# Altium schematic sheet moFOC-Main.SchDoc
size A4; Organization: Altium Limited; Address1: L3, 12a Rodborough Rd; Address2: Frenchs Forest; Address3: NSW; Address4: Australia 2086
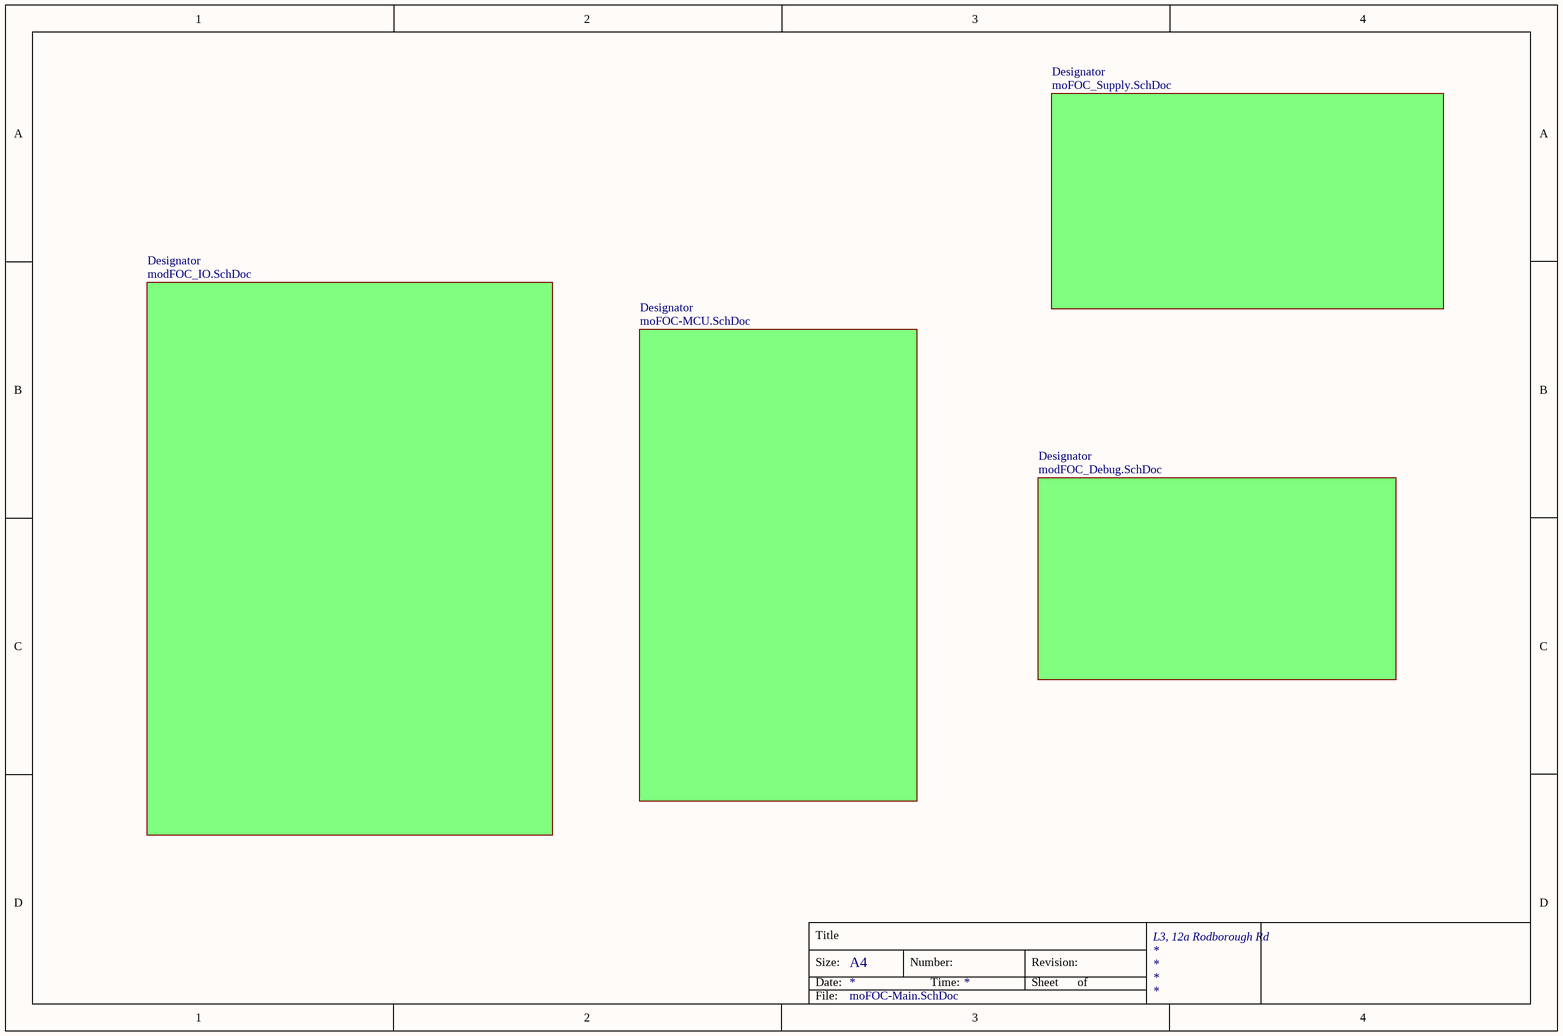
[diagram p0: moFOC-Main.SchDoc]

## Sub-sheets
Designator = moFOC-MCU.SchDoc: no entries
Designator = moFOC_Supply.SchDoc: no entries
Designator = modFOC_IO.SchDoc: no entries
Designator = modFOC_Debug.SchDoc: no entries

## Notes on the sheet
- Title
- Size:
- Date:
- A4
- Number:
- Time:
- Revision:
- Sheet
- of
- File: